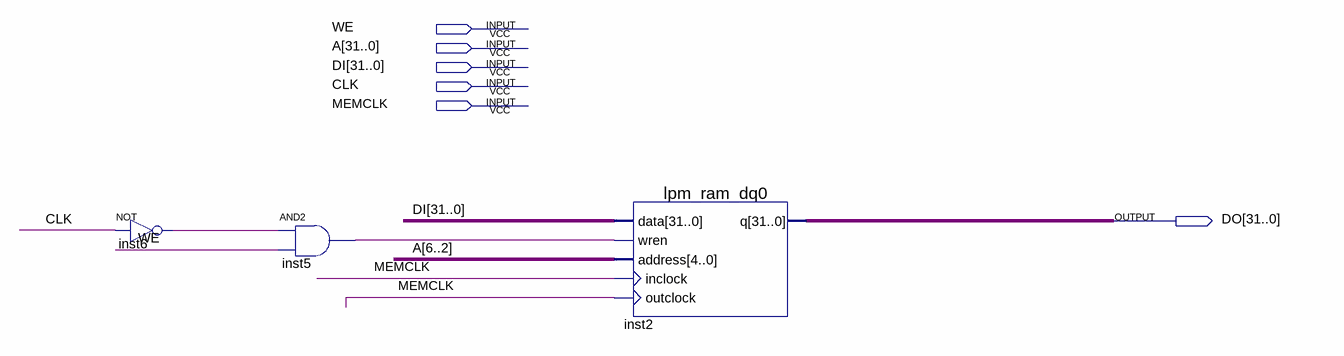
[diagram p0: schematic sheet]
// Quartus schematic sc_datamem.bdf as structural Verilog: 3 symbols, 6 pins
module sc_datamem (
  input  WE,
  input  [31:0] A,
  input  [31:0] DI,
  input  CLK,
  input  MEMCLK,
  output [31:0] DO
);

  wire inst5_out, inst6_out;

  not inst6 (inst6_out, CLK);
  and inst5 (inst5_out, inst6_out, WE);
  lpm_ram_dq0 inst2 (.data(DI), .wren(inst5_out), .address(A[6:2]), .inclock(MEMCLK), .outclock(MEMCLK), .q(DO));
endmodule
